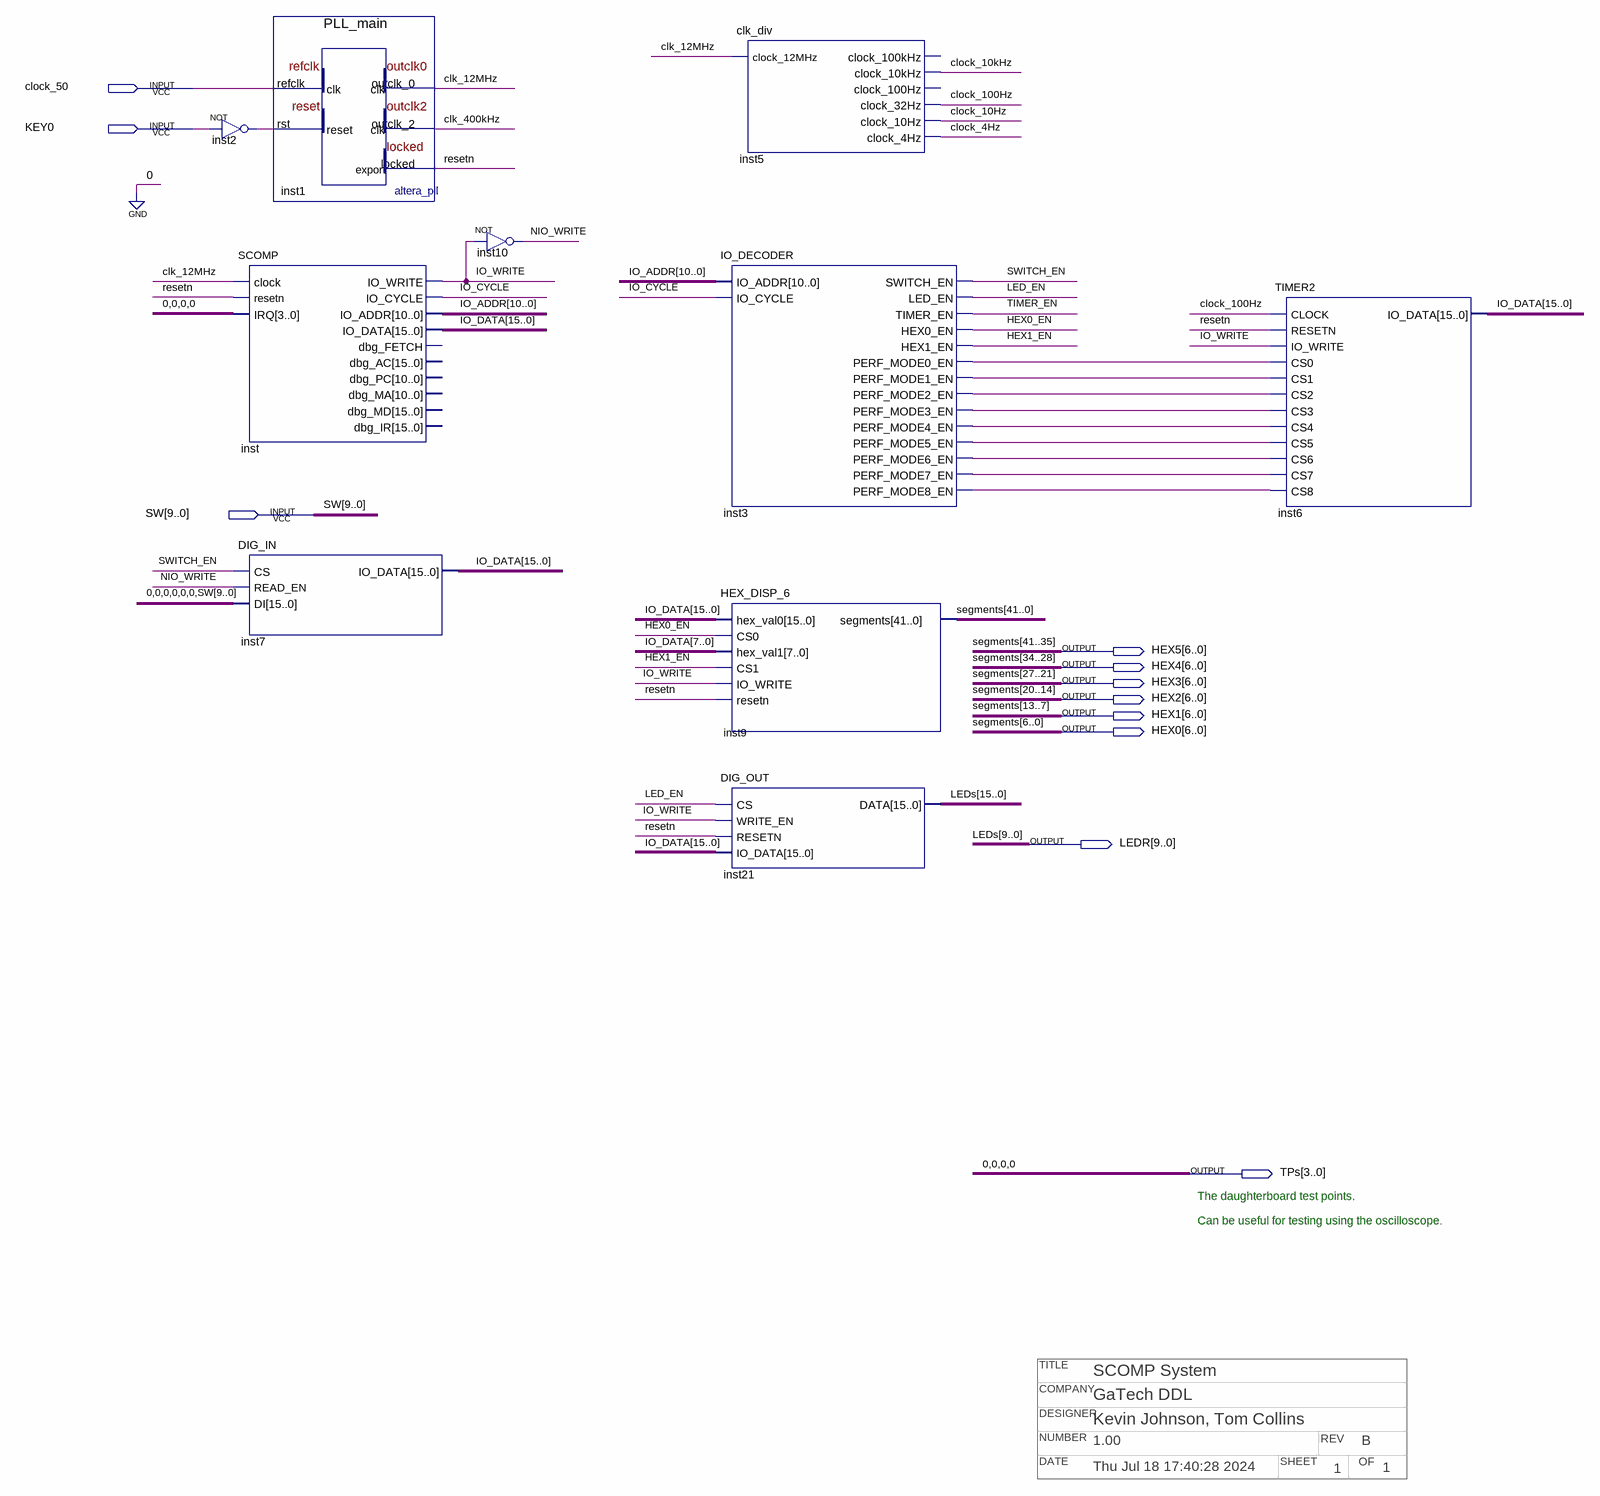
[diagram p0: schematic sheet]
// Quartus schematic SCOMP_System.bdf as structural Verilog: 10 symbols, 11 pins
// Title block: TITLE: SCOMP System; COMPANY: GaTech DDL; DESIGNER: Kevin Johnson, Tom Collins; NUMBER: 1.00; REV: B; DATE: Thu Jul 18 17:40:28 2024; SHEET: 1; OF: 1
module SCOMP_System (
  input  clock_50,
  input  KEY0,
  input  [9:0] SW,
  output [6:0] HEX5,
  output [6:0] HEX4,
  output [6:0] HEX3,
  output [6:0] HEX2,
  output [6:0] HEX1,
  output [6:0] HEX0,
  output [9:0] LEDR,
  output [3:0] TPs
);

  wire clk_12MHz, clk_400kHz, clock_4Hz, clock_10Hz, clock_10kHz, clock_100Hz, HEX0_EN, HEX1_EN, inst2_out,
       inst3_perf_mode0_en, inst3_perf_mode1_en, inst3_perf_mode2_en, inst3_perf_mode3_en,
       inst3_perf_mode4_en, inst3_perf_mode5_en, inst3_perf_mode6_en, inst3_perf_mode7_en,
       inst3_perf_mode8_en, IO_CYCLE, IO_WRITE, LED_EN, NIO_WRITE, resetn, SWITCH_EN, TIMER_EN;
  wire [10:0] IO_ADDR;
  wire [15:0] IO_DATA;
  wire [15:10] LEDs;

  not inst2 (inst2_out, KEY0);
  SCOMP inst (
    .clock(clk_12MHz), .resetn(resetn), .IRQ(4'b0000), .IO_WRITE(IO_WRITE), .IO_CYCLE(IO_CYCLE),
    .IO_ADDR(IO_ADDR), .IO_DATA(IO_DATA));  // open: dbg_FETCH, dbg_AC, dbg_PC, dbg_MA, dbg_MD, dbg_IR
  DIG_IN inst7 (.CS(SWITCH_EN), .READ_EN(NIO_WRITE), .DI({{6{1'b0}}, SW}), .IO_DATA(IO_DATA));
  PLL_main inst1 (.refclk(clock_50), .rst(inst2_out), .outclk_0(clk_12MHz), .outclk_2(clk_400kHz), .locked(resetn));
  not inst10 (NIO_WRITE, IO_WRITE);
  clk_div inst5 (
    .clock_12MHz(clk_12MHz), .clock_10kHz(clock_10kHz), .clock_32Hz(clock_100Hz), .clock_10Hz(clock_10Hz),
    .clock_4Hz(clock_4Hz));  // open: clock_100kHz, clock_100Hz
  IO_DECODER inst3 (
    .IO_ADDR(IO_ADDR), .IO_CYCLE(IO_CYCLE), .SWITCH_EN(SWITCH_EN), .LED_EN(LED_EN), .TIMER_EN(TIMER_EN),
    .HEX0_EN(HEX0_EN), .HEX1_EN(HEX1_EN), .PERF_MODE0_EN(inst3_perf_mode0_en),
    .PERF_MODE1_EN(inst3_perf_mode1_en), .PERF_MODE2_EN(inst3_perf_mode2_en),
    .PERF_MODE3_EN(inst3_perf_mode3_en), .PERF_MODE4_EN(inst3_perf_mode4_en),
    .PERF_MODE5_EN(inst3_perf_mode5_en), .PERF_MODE6_EN(inst3_perf_mode6_en),
    .PERF_MODE7_EN(inst3_perf_mode7_en), .PERF_MODE8_EN(inst3_perf_mode8_en));
  HEX_DISP_6 inst9 (
    .hex_val0(IO_DATA), .CS0(HEX0_EN), .hex_val1(IO_DATA[7:0]), .CS1(HEX1_EN), .IO_WRITE(IO_WRITE),
    .resetn(resetn), .segments({HEX5, HEX4, HEX3, HEX2, HEX1, HEX0}));
  DIG_OUT inst21 (.CS(LED_EN), .WRITE_EN(IO_WRITE), .RESETN(resetn), .IO_DATA(IO_DATA), .DATA({LEDs, LEDR}));
  TIMER2 inst6 (
    .CLOCK(clock_100Hz), .RESETN(resetn), .IO_WRITE(IO_WRITE), .CS0(inst3_perf_mode0_en),
    .CS1(inst3_perf_mode1_en), .CS2(inst3_perf_mode2_en), .CS3(inst3_perf_mode3_en),
    .CS4(inst3_perf_mode4_en), .CS5(inst3_perf_mode5_en), .CS6(inst3_perf_mode6_en),
    .CS7(inst3_perf_mode7_en), .CS8(inst3_perf_mode8_en), .IO_DATA(IO_DATA));

  assign TPs = 4'b0000;

  // Other names for the same wires on the sheet: LEDs[9:0] = LEDR;
  //   segments[41:0] = {HEX5, HEX4, HEX3, HEX2, HEX1, HEX0}

  // Notes on the sheet:
  //   The daughterboard test points.
  //   Can be useful for testing using the oscilloscope.
endmodule
